# Altium schematic sheet POWER SECTION.SchDoc
size A4; SheetNumber: 2; SheetTotal: 27
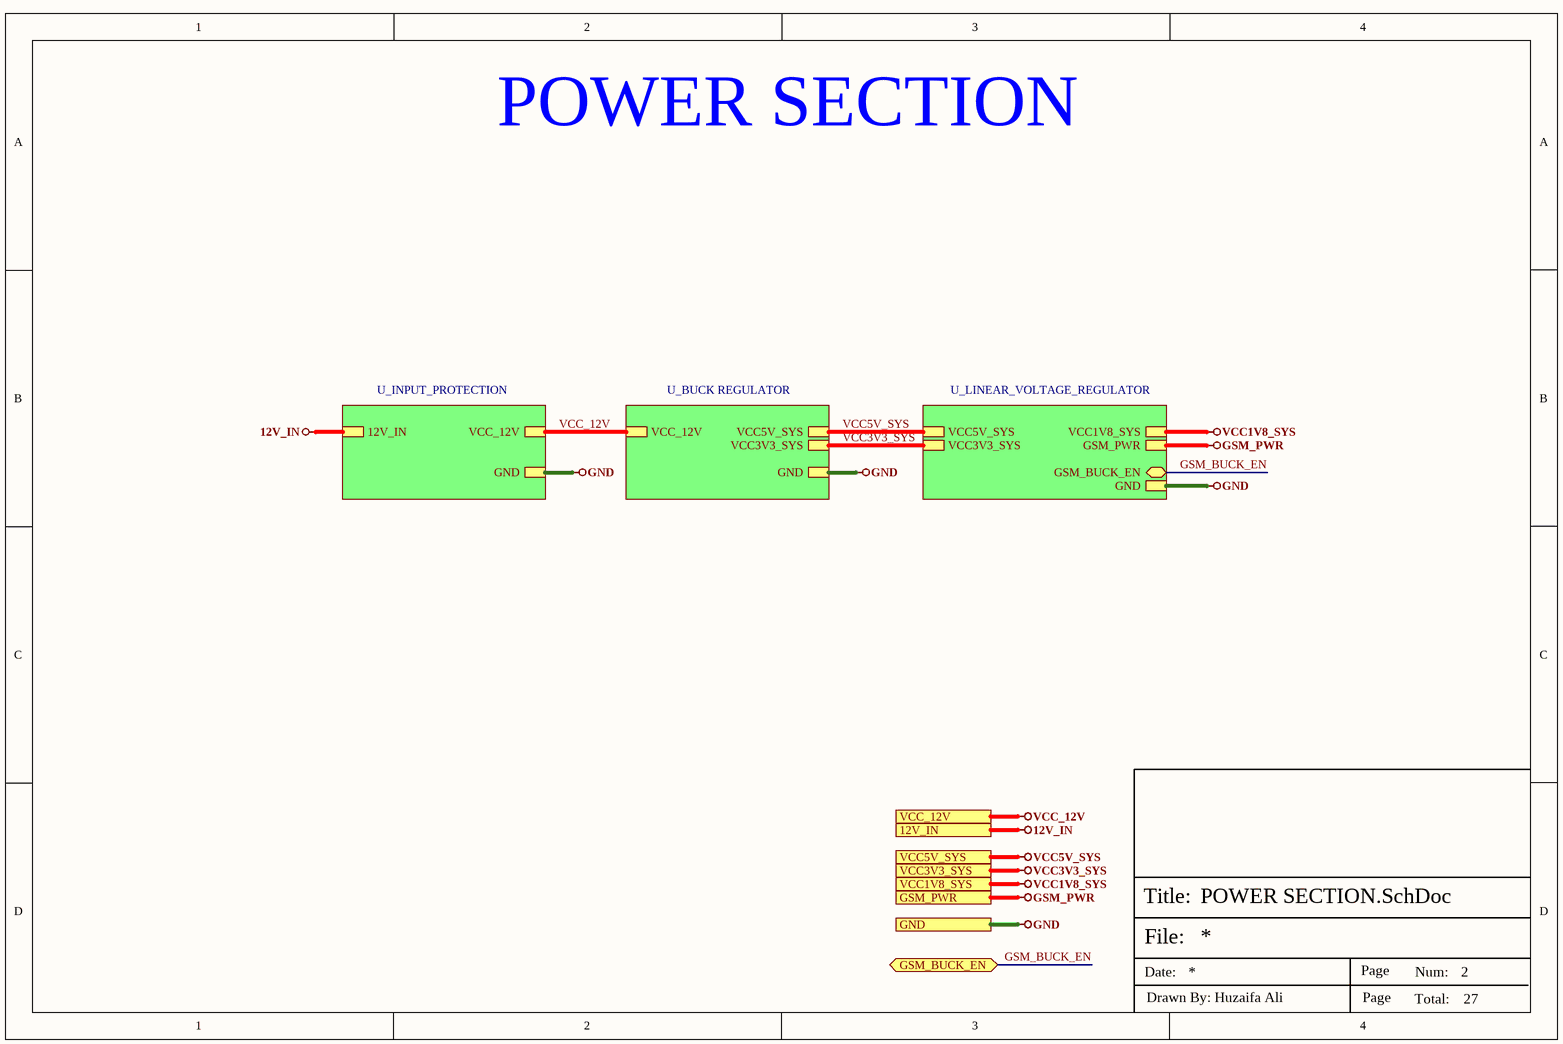
[diagram p0: POWER SECTION.SchDoc]

## Sub-sheets
U_BUCK REGULATOR = BUCK REGULATOR.SchDoc: VCC5V_SYS, GND, VCC3V3_SYS, VCC_12V
U_INPUT_PROTECTION = INPUT_PROTECTION.SchDoc: GND, VCC_12V, 12V_IN
U_LINEAR_VOLTAGE_REGULATOR = LINEAR_VOLTAGE_REG.SchDoc: VCC5V_SYS, GND, VCC3V3_SYS, GSM_BUCK_EN (bidir), VCC1V8_SYS, GSM_PWR

## Ports
12V_IN (see TOP SHEET[2A], INPUT_PROTECTION[3D]), GND (see TOP SHEET[2B], AUDIO_INTERFACE[1D], BUCK REGULATOR[3D], DEBUG_UART_INTERFACE[3D], DIGITAL IO_RELAY_SHEET[5D], DUAL_SIM_INTERFACE[3D], ETHERNET_PHY0[4D], ETHERNET_PHY1[4D], GSM_INTERFACE[2D], HDMI_INTERFACE[3D], INPUT_PROTECTION[3D], LINEAR_VOLTAGE_REG[3D], MICRO_SD_INTERFACE[3D], MIPI-DSI DISPLAY[3D], PUSH BUTTONs_INTERFACE[3C], RGB_LEDs_INTERFACE[3D], ROCKCHIP_PWR_SUPPLY[1D], ROCKCHIP_SYSTEM_CONTROL[3C], RS232_RS485_INTERFACE[3C], SENSOR_SHEET[3D], USB2.0_INTERFACE[3D], USB3.0_INTERFACE[3D], USB-C_INTERFACE[2D], WIEGAND_INTERFACE[3D], WIFI_BLUETOOTH_SHEET[4C]), GSM_BUCK_EN (bidir, see TOP SHEET[2B], LINEAR_VOLTAGE_REG[3D], ROCKCHIP_GPIO_NC PINS[3D]), GSM_PWR (see TOP SHEET[2A], GSM_INTERFACE[2D], LINEAR_VOLTAGE_REG[3D]), VCC1V8_SYS (see TOP SHEET[2A], ETHERNET_PHY0[4D], ETHERNET_PHY1[4D], LINEAR_VOLTAGE_REG[3D], ROCKCHIP_PWR_SUPPLY[1D], WIFI_BLUETOOTH_SHEET[4C]), VCC3V3_SYS (see TOP SHEET[2A], AUDIO_INTERFACE[1D], BUCK REGULATOR[3D], DEBUG_UART_INTERFACE[3D], DIGITAL IO_RELAY_SHEET[5D], ETHERNET_PHY0[4D], ETHERNET_PHY1[4D], GSM_INTERFACE[2D], HDMI_INTERFACE[3D], LINEAR_VOLTAGE_REG[3D], MIPI-DSI DISPLAY[3D], PUSH BUTTONs_INTERFACE[3C], ROCKCHIP_PWR_SUPPLY[1D], ROCKCHIP_SYSTEM_CONTROL[3C], RS232_RS485_INTERFACE[3C], SENSOR_SHEET[3D], USB-C_INTERFACE[2D], WIEGAND_INTERFACE[3D], WIFI_BLUETOOTH_SHEET[4C]), VCC5V_SYS (see TOP SHEET[2A], BUCK REGULATOR[3D], DIGITAL IO_RELAY_SHEET[5D], HDMI_INTERFACE[3D], LINEAR_VOLTAGE_REG[3D], MIPI-DSI DISPLAY[3D], RGB_LEDs_INTERFACE[3D], ROCKCHIP_PWR_SUPPLY[1D], USB2.0_INTERFACE[3D], USB3.0_INTERFACE[3D], USB-C_INTERFACE[2D], WIEGAND_INTERFACE[3D]), VCC_12V (see TOP SHEET[2A], AUDIO_INTERFACE[1D], BUCK REGULATOR[3D], INPUT_PROTECTION[3D], PUSH BUTTONs_INTERFACE[3C], WIEGAND_INTERFACE[3D])

## Nets
12V_IN: port 12V_IN, sheet U_INPUT_PROTECTION/12V_IN
GND: port GND, sheet U_INPUT_PROTECTION/GND, sheet U_BUCK REGULATOR/GND, sheet U_LINEAR_VOLTAGE_REGULATOR/GND
GSM_PWR: port GSM_PWR, sheet U_LINEAR_VOLTAGE_REGULATOR/GSM_PWR
VCC1V8_SYS: port VCC1V8_SYS, sheet U_LINEAR_VOLTAGE_REGULATOR/VCC1V8_SYS
VCC3V3_SYS: port VCC3V3_SYS, sheet U_BUCK REGULATOR/VCC3V3_SYS, sheet U_LINEAR_VOLTAGE_REGULATOR/VCC3V3_SYS
VCC5V_SYS: port VCC5V_SYS, sheet U_BUCK REGULATOR/VCC5V_SYS, sheet U_LINEAR_VOLTAGE_REGULATOR/VCC5V_SYS
VCC_12V: port VCC_12V, sheet U_INPUT_PROTECTION/VCC_12V, sheet U_BUCK REGULATOR/VCC_12V
GSM_BUCK_EN: port GSM_BUCK_EN, sheet U_LINEAR_VOLTAGE_REGULATOR/GSM_BUCK_EN

## Notes on the sheet
- POWER SECTION
- File:
- Title:
- Date:
- Page
- Num:
- Total:
- Drawn By: Huzaifa Ali